# Altium schematic sheet SS-12D11G3R1_SS-12D11G3R.schdoc
size 127 x 101 mm
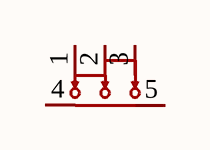
[diagram p0: SS-12D11G3R1_SS-12D11G3R.schdoc]

## Parts
SW?  SS-12D11G3R  [SW-TH_SS-12D11L3]  (value not drawn)

## Nets

Not connected (* = marked no-connect by the designer): SW? 1 2 3 4 5

## Library data of the parts
SW? = SS-12D11G3R: Manufacturer: XKB Connectivity(中国星坤); Add into BOM: yes; Circuit: SPDT; Actuator Style: Rectangular columnar; Pin Style: PCPin; Switch Length: 13.5mm; Switch Width: 6.6mm; Switch Height: 6.3mm; Actuator Color: Black; Current Rating (DC): 3A; Voltage Rating (DC): 125V; Mechanical Life: 1万次; Symbol: SS-12D11G3R; Device: SS-12D11G3R; LCSC Part Name: 柄长3mm 弯插双档 滑动开关; Supplier Part: C843362; Manufacturer Part: SS-12D11G3R; Supplier Footprint: 插件; JLCPCB Part Class: Extended Part; Datasheet: https://atta.szlcsc.com/upload/public/pdf/source/20211009/84F89DEF741E27E9E55DE4039DC07CAD.pdf; Supplier: LCSC; Convert to PCB: yes; Mounting Style: Right-Angle; Current Rating (AC): 3A; Voltage Rating (AC): 125V; Operating Temperature: -40℃~+85℃